# Altium project BEE-1012 PAY-EXP_V110.PrjPcb (part 7 of 7)

## Sheet 21_POWER_PWR_SEN.SchDoc
size 420 x 297 mm; SheetNumber: 34; SheetTotal: 36
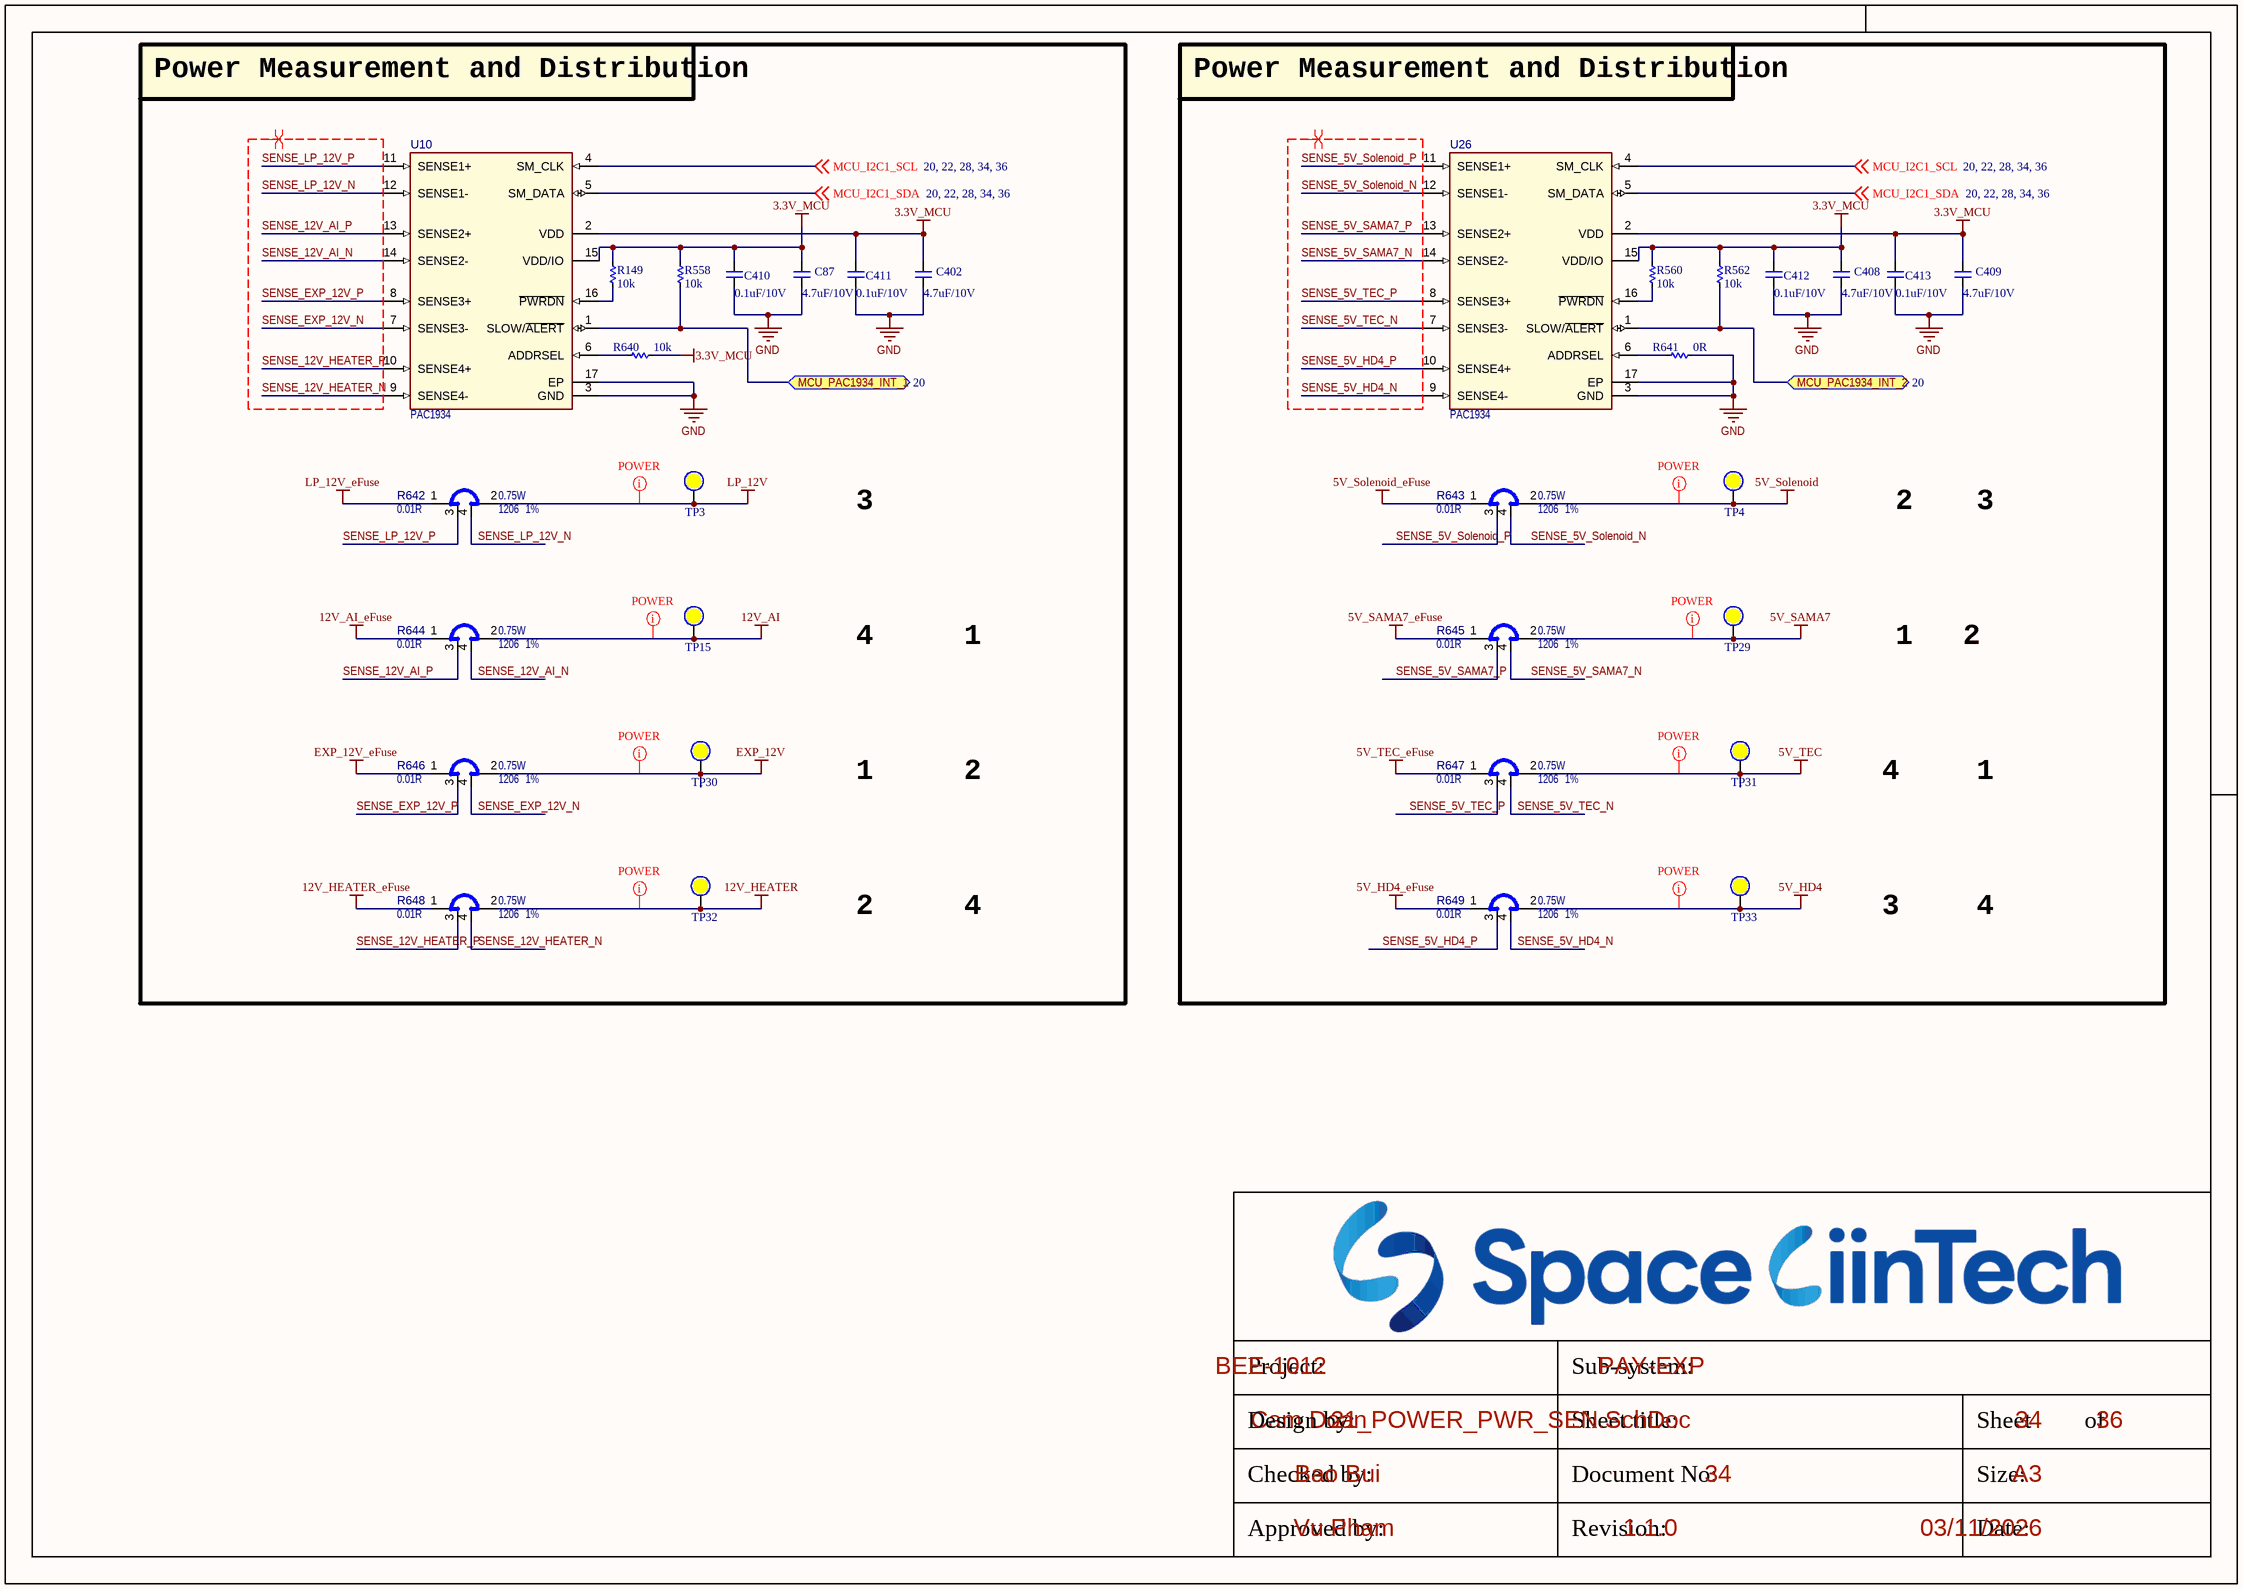
[diagram p35: 21_POWER_PWR_SEN.SchDoc]

### Parts
(Parts that share a designator on the sheet are numbered #1, #2 ... from top to bottom, then left to right.)
C87#2  4.7uF/10V  [CAP_C_1005X60]
C402  4.7uF/10V  [CAP_C_1005X60]
C408  4.7uF/10V  [CAP_C_1005X60]
C409  4.7uF/10V  [CAP_C_1005X60]
C410  0.1uF/10V  [CAP_C_1005X60]
C411  0.1uF/10V  [CAP_C_1005X60]
C412  0.1uF/10V  [CAP_C_1005X60]
C413  0.1uF/10V  [CAP_C_1005X60]
R149#2  10k  [RES_C_1005X40]
R558#1  10k  [RES_C_1005X40]
R560#1  10k  [RES_C_1005X40]
R562#1  10k  [RES_C_1005X40]
R640  10k  [RES_C_1005X40]
R641  0R  [RES_C_1005X40]
R642  value 0.01R  Package: 1206  Tolerance: 1%  Power: 0.75W  [RES_C_1206_SHUNT]  (hidden comment: KRL1632E-M-R010-F-T5)
R643  value 0.01R  Package: 1206  Tolerance: 1%  Power: 0.75W  [RES_C_1206_SHUNT]  (hidden comment: KRL1632E-M-R010-F-T5)
R644  value 0.01R  Package: 1206  Tolerance: 1%  Power: 0.75W  [RES_C_1206_SHUNT]  (hidden comment: KRL1632E-M-R010-F-T5)
R645  value 0.01R  Package: 1206  Tolerance: 1%  Power: 0.75W  [RES_C_1206_SHUNT]  (hidden comment: KRL1632E-M-R010-F-T5)
R646  value 0.01R  Package: 1206  Tolerance: 1%  Power: 0.75W  [RES_C_1206_SHUNT]  (hidden comment: KRL1632E-M-R010-F-T5)
R647  value 0.01R  Package: 1206  Tolerance: 1%  Power: 0.75W  [RES_C_1206_SHUNT]  (hidden comment: KRL1632E-M-R010-F-T5)
R648  value 0.01R  Package: 1206  Tolerance: 1%  Power: 0.75W  [RES_C_1206_SHUNT]  (hidden comment: KRL1632E-M-R010-F-T5)
R649  value 0.01R  Package: 1206  Tolerance: 1%  Power: 0.75W  [RES_C_1206_SHUNT]  (hidden comment: KRL1632E-M-R010-F-T5)
TP3#2  (no value)  [Testpoint_80]  (no BOM)
TP4#2  (no value)  [Testpoint_80]  (no BOM)
TP15  (no value)  [Testpoint_80]  (no BOM)
TP29  (no value)  [Testpoint_80]  (no BOM)
TP30  (no value)  [Testpoint_80]  (no BOM)
TP31  (no value)  [Testpoint_80]  (no BOM)
TP32  (no value)  [Testpoint_80]  (no BOM)
TP33  (no value)  [Testpoint_80]  (no BOM)
U10#2  value PAC1934  [UQFN-16_4X4_EP2.6X2.6]  (hidden comment: PAC1934 UQFN-16)
U26  value PAC1934  [UQFN-16_4X4_EP2.6X2.6]  (hidden comment: PAC1934 UQFN-16)

### Ports
MCU_PAC1934_INT_1 (bidir, see 20), MCU_PAC1934_INT_2 (bidir, see 20)

### Nets
3.3V_MCU: C87#2.1 C402.1 C408.1 C409.1 C410.1 C411.1 C412.1 C413.1 R149#2.1 R558#1.1 R560#1.1 R562#1.1 R640.2 U10#2.2(VDD) U10#2.15(VDD/IO) U26.2(VDD) U26.15(VDD/IO)
5V_HD4: R649.2 TP33.1
5V_HD4_eFuse: R649.1
5V_SAMA7: R645.2 TP29.1
5V_SAMA7_eFuse: R645.1
5V_Solenoid: R643.2 TP4#2.1
5V_Solenoid_eFuse: R643.1
5V_TEC: R647.2 TP31.1
5V_TEC_eFuse: R647.1
12V_AI: R644.2 TP15.1
12V_AI_eFuse: R644.1
12V_HEATER: R648.2 TP32.1
12V_HEATER_eFuse: R648.1
EXP_12V: R646.2 TP30.1
EXP_12V_eFuse: R646.1
GND: C87#2.2 C402.2 C408.2 C409.2 C410.2 C411.2 C412.2 C413.2 R641.2 U10#2.3(GND) U10#2.17(EP) U26.3(GND) U26.17(EP)
LP_12V: R642.2 TP3#2.1
LP_12V_eFuse: R642.1
MCU_I2C1_SCL: U10#2.4(SM_CLK) U26.4(SM_CLK) ; off-sheet MCU_I2C1_SCL
MCU_I2C1_SDA: U10#2.5(SM_DATA) U26.5(SM_DATA) ; off-sheet MCU_I2C1_SDA
SENSE_5V_HD4_N: R649.4 U26.9(SENSE4-)
SENSE_5V_HD4_P: R649.3 U26.10(SENSE4+)
SENSE_5V_SAMA7_N: R645.4 U26.14(SENSE2-)
SENSE_5V_SAMA7_P: R645.3 U26.13(SENSE2+)
SENSE_5V_Solenoid_N: R643.4 U26.12(SENSE1-)
SENSE_5V_Solenoid_P: R643.3 U26.11(SENSE1+)
SENSE_5V_TEC_N: R647.4 U26.7(SENSE3-)
SENSE_5V_TEC_P: R647.3 U26.8(SENSE3+)
SENSE_12V_AI_N: R644.4 U10#2.14(SENSE2-)
SENSE_12V_AI_P: R644.3 U10#2.13(SENSE2+)
SENSE_12V_HEATER_N: R648.4 U10#2.9(SENSE4-)
SENSE_12V_HEATER_P: R648.3 U10#2.10(SENSE4+)
SENSE_EXP_12V_N: R646.4 U10#2.7(SENSE3-)
SENSE_EXP_12V_P: R646.3 U10#2.8(SENSE3+)
SENSE_LP_12V_N: R642.4 U10#2.12(SENSE1-)
SENSE_LP_12V_P: R642.3 U10#2.11(SENSE1+)
NetR149#2_2: R149#2.2 U10#2.16(~{PWRDN})
NetR558#1_2: R558#1.2 U10#2.1(SLOW/~{ALERT}) ; port MCU_PAC1934_INT_1
NetR560#1_2: R560#1.2 U26.16(~{PWRDN})
NetR562#1_2: R562#1.2 U26.1(SLOW/~{ALERT}) ; port MCU_PAC1934_INT_2
NetR640_1: R640.1 U10#2.6(ADDRSEL)
NetR641_1: R641.1 U26.6(ADDRSEL)

### Layout directives
net class POWER: 5V_HD4, 5V_SAMA7, 5V_Solenoid, 5V_TEC, 12V_AI, 12V_HEATER, EXP_12V, LP_12V
differential pair; net class DIFF100; differential pair class DIFF100: SENSE_5V_HD4_N, SENSE_5V_HD4_P, SENSE_5V_SAMA7_N, SENSE_5V_SAMA7_P, SENSE_5V_Solenoid_N, SENSE_5V_Solenoid_P, SENSE_5V_TEC_N, SENSE_5V_TEC_P, SENSE_12V_AI_N, SENSE_12V_AI_P, SENSE_12V_HEATER_N, SENSE_12V_HEATER_P, SENSE_EXP_12V_N, SENSE_EXP_12V_P, SENSE_LP_12V_N, SENSE_LP_12V_P

### Notes on the sheet
- Power Measurement and Distribution
- 3
- 2
- 4
- 1
- Project:
- Sub-system:
- Design by:
- Sheet title:
- Sheet
- of
- Checked by:
- Approved by:
- Revision:
- Document No:
- Size:
- Date:
- A3

### Library data of the parts
C87#2 C402 C408-C413 = _CAP_C_2: CAP
R149#2 R558#1 R560#1 R562#1 R640 R641 = _RES_B_2: RES
R642-R649 = RSMT1316: Shunt; Manufacturer 1: SUSUMU; Description_: RES SHUNT MF 0.01R 1% 0.75W SMD 1206; Dev Tools Status: Design; Temperature Coeffcient: 50ppm/C; Current: 8A; Owner: Ciprian Abramov; Populated: YES; MCHP-ID: RSMT1316; Revision: 1; Symbol: Shunt 4 Pin; Status: MCL Design; ComponentLink1URL: https://chn-vm-apps.microchip.com/mchprepo/parts/Datasheets/n_catalog_partition09_en.pdf; ComponentLink1Description: SVN Datasheet; ComponentLink2URL: C:\ALTIUM_WORK\00001_MCHP-CDB\Datasheets\n_catalog_partition09_en.pdf; ComponentLink2Description: Local Datasheet; ComponentLink3URL: C:\ALTIUM_WORK\00001_MCHP-CDB\Library\LibraryRefs\Shunt 4 Pin.SchLib; ComponentLink3Description: Open Symbol; ComponentLink4URL: C:\ALTIUM_WORK\00001_MCHP-CDB\Library\Footprints\RES_C_1206_SHUNT.PcbLib; ComponentLink4Description: Open Footprint; ComponentLink5Description: Open Footprint 2; ComponentLink6Description: Open Footprint 3; ComponentLink7Description: Open Footprint 4; Operating Temperature: -55C to +155C; Category: Resistor; Type: RES SMD; Composition: MF; Manufacturer Part Number 1: KRL1632E-M-R010-F-T5; Supplier 1: Digi-Key; Supplier Part Number 1: 408-1570-1-ND; Quantity Override: 1
TP3#2 TP4#2 TP15 TP29-TP33 = Test Point: Solder: NF
U10#2 U26 = MIC8883: Manufacturer 1: Microchip Technology; Manufacturer Part Number 1: PAC1934T-I/JQ; Description_: MCHP ANALOG POWER CURRENT SENSE MONITOR PAC1934T-I/JQ UQFN-16; Dev Tools Status: Design; Owner: Ciprian Abramov; Populated: YES; MCHP-ID: MIC8883; Symbol: PAC1934 UQFN-16; Type: Power/Current Sensor; Status: MCL Design; Revision: 1; Category: MCHP-Analog; ComponentLink1Description: SVN Datasheet; ComponentLink2Description: Local Datasheet; ComponentLink3URL: C:\ALTIUM_WORK\00001_MCHP-CDB\Library\LibraryRefs\PAC1934 UQFN-16.SchLib; ComponentLink3Description: Open Symbol; ComponentLink4URL: C:\ALTIUM_WORK\00001_MCHP-CDB\Library\Footprints\UQFN-16_4X4_EP2.6X2.6.PcbLib; ComponentLink4Description: Open Footprint; ComponentLink5Description: Open Footprint 2; ComponentLink6Description: Open Footprint 3; ComponentLink7Description: Open Footprint 4; Supplier 1: Digi-Key; Supplier Part Number 1: PAC1934T-I/JQCT-ND; Quantity Override: 1

## Sheet MOUTING.SchDoc
size 420 x 297 mm; SheetNumber: 35; SheetTotal: 35
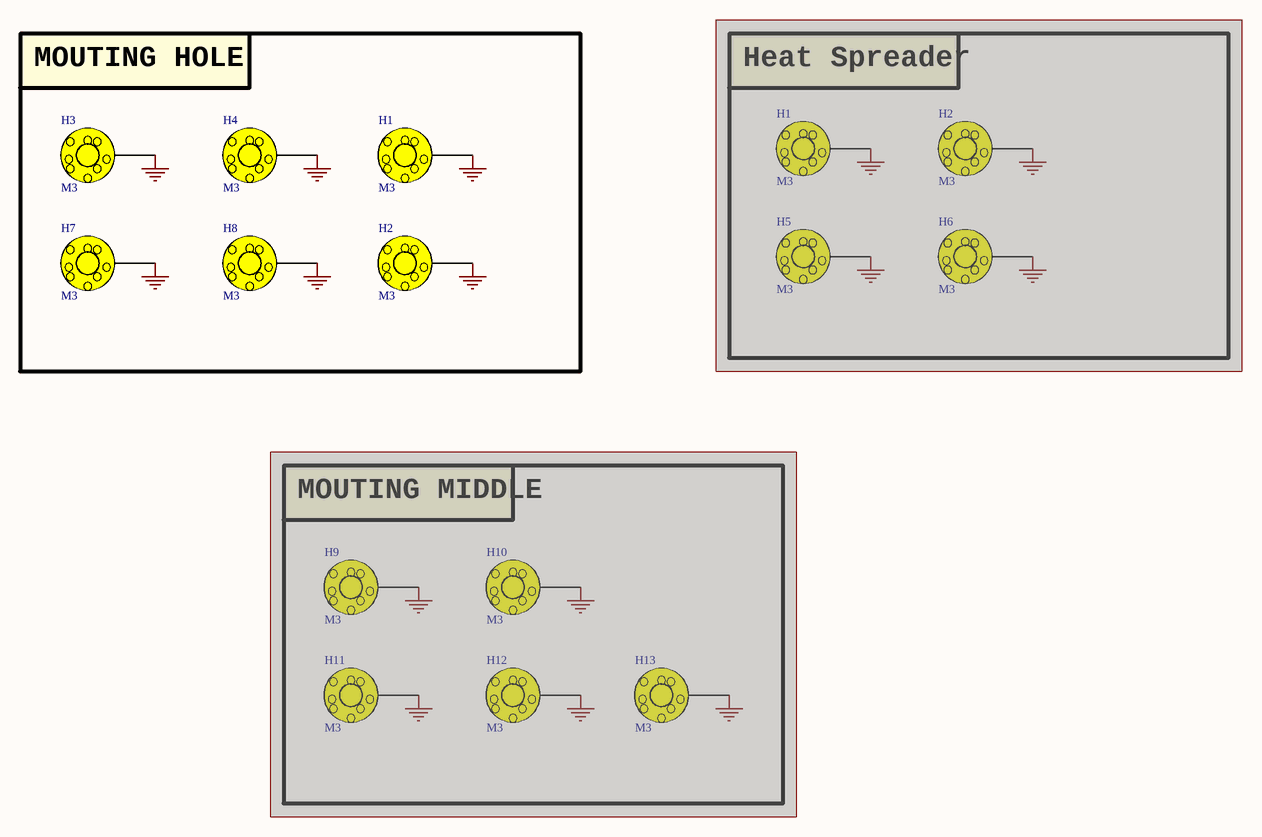
[diagram p36: MOUTING.SchDoc]

### Parts
(Parts that share a designator on the sheet are numbered #1, #2 ... from top to bottom, then left to right.)
H1#1  M3  [HEX-M3_NoVia]  (masked out: inside a compile mask, not in the netlist)
H1#2  M3  [HEX-M3_NoVia]
H2#1  M3  [HEX-M3_NoVia]  (masked out: inside a compile mask, not in the netlist)
H2#2  M3  [HEX-M3_NoVia]
H3  M3  [HEX-M3_NoVia]
H4  M3  [HEX-M3_NoVia]
H5  M3  [HEX-M3_NoVia]  (masked out: inside a compile mask, not in the netlist)
H6  M3  [HEX-M3_NoVia]  (masked out: inside a compile mask, not in the netlist)
H7  M3  [HEX-M3_NoVia]
H8  M3  [HEX-M3_NoVia]
H9  M3  [HEX-M3_NoVia]  (masked out: inside a compile mask, not in the netlist)
H10  M3  [HEX-M3_NoVia]  (masked out: inside a compile mask, not in the netlist)
H11  M3  [HEX-M3_NoVia]  (masked out: inside a compile mask, not in the netlist)
H12  M3  [HEX-M3_NoVia]  (masked out: inside a compile mask, not in the netlist)
H13  M3  [HEX-M3_NoVia]  (masked out: inside a compile mask, not in the netlist)

### Blocks framed on the sheet
MOUTING HOLE: H1#2 H2#2 H3 H4 H7 H8
Heat Spreader: H1#1 H2#1 H5 H6
MOUTING MIDDLE: H9-H13

### Nets
GND: H1#2.1 H2#2.1 H3.1 H4.1 H7.1 H8.1

### Notes on the sheet
- Project:
- Sub-system:
- Design by:
- Sheet title:
- Sheet
- of
- Checked by:
- Approved by:
- Revision:
- Document No:
- Size:
- Date:
- A3

### Library data of the parts
H1#1 H1#2 H2#1 H2#2 H3-H13 = HEX-M3

## Sheet ANA_SWITCH.SchDoc
size 420 x 297 mm; SheetNumber: 36; SheetTotal: 36
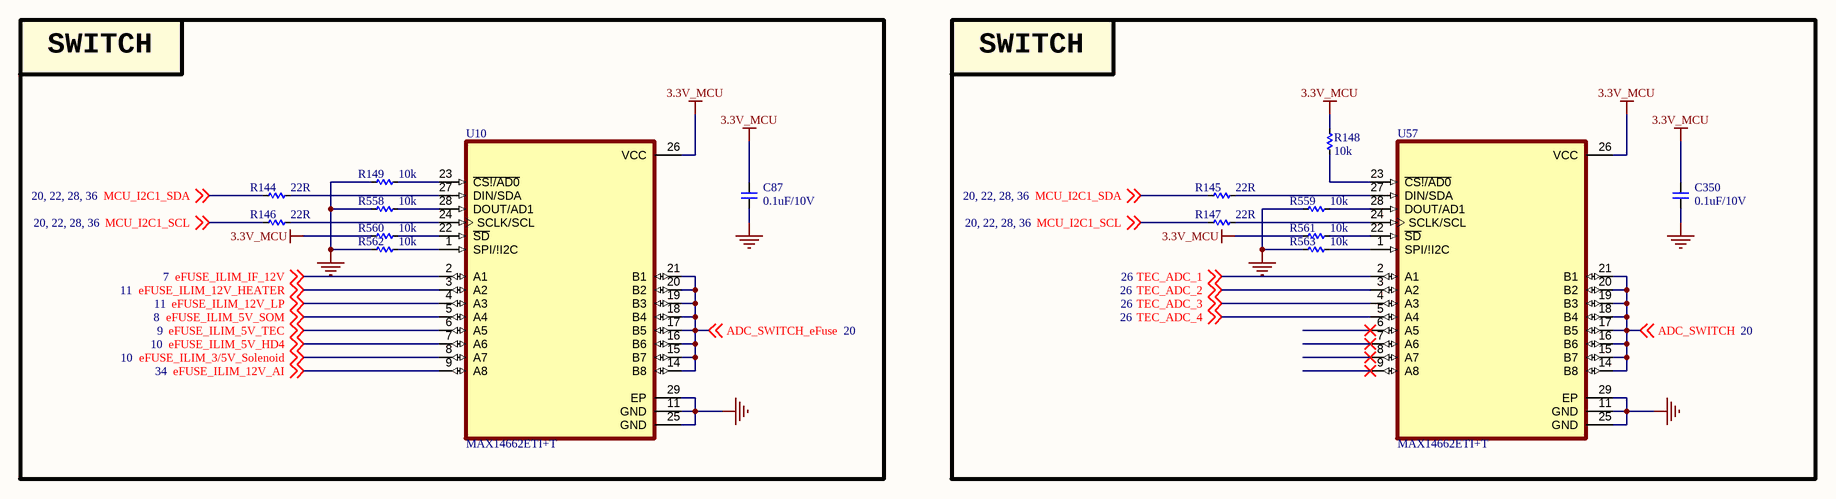
[diagram p37: ANA_SWITCH.SchDoc]

### Parts
(Parts that share a designator on the sheet are numbered #1, #2 ... from top to bottom, then left to right.)
C87#3  0.1uF/10V  [CAP_C_1005X60]
C350  0.1uF/10V  [CAP_C_1005X60]
R144#3  22R  [RES_C_1005X40]
R145#2  22R  [RES_C_1005X40]
R146#3  22R  [RES_C_1005X40]
R147#2  22R  [RES_C_1005X40]
R148#2  10k  [RES_C_1005X40]
R149#3  10k  [RES_C_1005X40]
R558#2  10k  [RES_C_1005X40]
R559  10k  [RES_C_1005X40]
R560#2  10k  [RES_C_1005X40]
R561  10k  [RES_C_1005X40]
R562#2  10k  [RES_C_1005X40]
R563  10k  [RES_C_1005X40]
U10#3  MAX14662ETI+T  [QFN40P400X400X80-29N]
U57  MAX14662ETI+T  [QFN40P400X400X80-29N]

### Blocks framed on the sheet
SWITCH: C87#3 R144#3 R146#3 R149#3 R558#2 R560#2 R562#2 U10#3
SWITCH: C350 R145#2 R147#2 R148#2 R559 R561 R563 U57

### Nets
3.3V_MCU: C87#3.2 C350.2 R148#2.1 R560#2.1 R561.1 U10#3.26(VCC) U57.26(VCC)
GND: C87#3.1 C350.1 R149#3.1 R558#2.1 R559.1 R562#2.1 R563.1 U10#3.11(GND) U10#3.25(GND) U10#3.29(EP) U57.11(GND) U57.25(GND) U57.29(EP)
ADC_SWITCH: U57.14(B8) U57.15(B7) U57.16(B6) U57.17(B5) U57.18(B4) U57.19(B3) U57.20(B2) U57.21(B1) ; off-sheet ADC_SWITCH
ADC_SWITCH_eFuse: U10#3.14(B8) U10#3.15(B7) U10#3.16(B6) U10#3.17(B5) U10#3.18(B4) U10#3.19(B3) U10#3.20(B2) U10#3.21(B1) ; off-sheet ADC_SWITCH_eFuse
eFUSE_ILIM_3/5V_Solenoid: U10#3.8(A7) ; off-sheet eFUSE_ILIM_3/5V_Solenoid
eFUSE_ILIM_5V_HD4: U10#3.7(A6) ; off-sheet eFUSE_ILIM_5V_HD4
eFUSE_ILIM_5V_SOM: U10#3.5(A4) ; off-sheet eFUSE_ILIM_5V_SOM
eFUSE_ILIM_5V_TEC: U10#3.6(A5) ; off-sheet eFUSE_ILIM_5V_TEC
eFUSE_ILIM_12V_AI: U10#3.9(A8) ; off-sheet eFUSE_ILIM_12V_AI
eFUSE_ILIM_12V_HEATER: U10#3.3(A2) ; off-sheet eFUSE_ILIM_12V_HEATER
eFUSE_ILIM_12V_LP: U10#3.4(A3) ; off-sheet eFUSE_ILIM_12V_LP
eFUSE_ILIM_IF_12V: U10#3.2(A1) ; off-sheet eFUSE_ILIM_IF_12V
MCU_I2C1_SCL: R146#3.1 R147#2.1 ; off-sheet MCU_I2C1_SCL
MCU_I2C1_SDA: R144#3.1 R145#2.1 ; off-sheet MCU_I2C1_SDA
TEC_ADC_1: U57.2(A1) ; off-sheet TEC_ADC_1
TEC_ADC_2: U57.3(A2) ; off-sheet TEC_ADC_2
TEC_ADC_3: U57.4(A3) ; off-sheet TEC_ADC_3
TEC_ADC_4: U57.5(A4) ; off-sheet TEC_ADC_4
NetR144#3_2: R144#3.2 U10#3.27(DIN/SDA)
NetR145#2_2: R145#2.2 U57.27(DIN/SDA)
NetR146#3_2: R146#3.2 U10#3.24(SCLK/SCL)
NetR147#2_2: R147#2.2 U57.24(SCLK/SCL)
NetR148#2_2: R148#2.2 U57.23(~{CS!/AD0})
NetR149#3_2: R149#3.2 U10#3.23(~{CS!/AD0})
NetR558#2_2: R558#2.2 U10#3.28(DOUT/AD1)
NetR559_2: R559.2 U57.28(DOUT/AD1)
NetR560#2_2: R560#2.2 U10#3.22(~{SD})
NetR561_2: R561.2 U57.22(~{SD})
NetR562#2_2: R562#2.2 U10#3.1(SPI/!I2C)
NetR563_2: R563.2 U57.1(SPI/!I2C)

Not connected (* = marked no-connect by the designer): U57 6(A5)* 7(A6)* 8(A7)* 9(A8)*

### Notes on the sheet
- Project:
- Sub-system:
- Design by:
- Sheet title:
- Sheet
- of
- Checked by:
- Approved by:
- Revision:
- Document No:
- Size:
- Date:
- A3

### Library data of the parts
C87#3 C350 = _CAP_C_2: CAP
R144#3 R145#2 R146#3 R147#2 R148#2 R149#3 R558#2 R559 R560#2 R561 R562#2 R563 = _RES_B_2: RES
U10#3 U57 = IC_SW_MAX14662ETI+T: 8 Circuit IC Switch 1:1 1Ohm 28-TQFN _4x4_; MF: Maxim Integrated; Package: TQFN-28 Maxim; Value: *; Price: None; MP: MAX14662ETI+T; SnapEDA_Link: https://www.snapeda.com/parts/MAX14662ETI%2BT/Maxim%20Integrated/view-part/546683/?ref=snap; Availability: Unavailable

## Nets that join several sheets
3.3_VBAT: 08_SAMA7G54-MPU (R332.1), 13_MRAM_RTC_WDT (5 pins)
3.3V_MCU: 05_CONNECTOR_OUT (8 pins), 06_POWER_1 (5 pins), 07_CAN (C184.1 C185.1 U41.3), 11_MCU (23 pins), 12_CONSOLE (C141.2 J19.1 R246.2 R247.2), 13_MRAM_RTC_WDT (28 pins), 13_PRAM (12 pins), 14_NTC_TEMPSENSOR (18 pins), 16_TEC (12 pins), 17_FLOW_Sensor (34 pins), 17_I2C_Sensor_OnBoard (13 pins), 18_HD4_PUMP (C117.2 R197.1 R198.1 U17.1), 19_SOLENOID_HB_1 (15 pins), 21_POWER_PWR_SEN (17 pins), ANA_SWITCH (7 pins)
3.3V_SAMA7: 05_CONNECTOR_OUT (R273.1 R274.1 R276.1), 06_POWER_2 (5 pins), 07_CAN (6 pins), 08_SOM_USB_CARD (14 pins), 10_USB (12 pins), 12_CONSOLE (27 pins), 13_MRAM_RTC_WDT (R454.2), 13_PRAM (R580#2.2 R584#2.2)
5V_HD4: 06_POWER_4 (8 pins), 18_HD4_PUMP (10 pins), 21_POWER_PWR_SEN (R649.2 TP33.1)
5V_MCU: 06_POWER_1 (7 pins), 06_POWER_2 (6 pins), 06_POWER_3 (R411.1 R416.1), 06_POWER_4 (R424.1 R432.1), 06_POWER_5 (R128.1 R210.1), 20_AI_Board (R602.1)
5V_PERI: 06_POWER_3 (10 pins), 06_POWER_4 (10 pins)
5V_SAMA7: 05_CONNECTOR_IN (JP19.1), 05_CONNECTOR_OUT (J24.11), 06_POWER_2 (C147.1 DS3.2 VR2.3), 08_SAMA7G54-PMIC (13 pins), 08_SAMA7G54-PIO (R533.1), 21_POWER_PWR_SEN (R645.2 TP29.1)
5V_SAMA7_eFuse: 06_POWER_2 (7 pins), 21_POWER_PWR_SEN (R645.1)
5V_Solenoid: 06_POWER_4 (8 pins), 19_SOLENOID_HB_1 (55 pins), 21_POWER_PWR_SEN (R643.2 TP4#2.1)
5V_TEC: 06_POWER_3 (8 pins), 16_TEC (20 pins), 21_POWER_PWR_SEN (R647.2 TP31.1)
12V_AI: 20_AI_Board (C395.2 C396.2 U73#2.7), 21_POWER_PWR_SEN (R644.2 TP15.1)
12V_AI_eFuse: 20_AI_Board (7 pins), 21_POWER_PWR_SEN (R644.1)
12V_HEATER: 06_POWER_5 (8 pins), 15_HEATER (17 pins), 21_POWER_PWR_SEN (R648.2 TP32.1)
EXP_12V: 06_POWER_1 (C8#2.2 C9.2 U2.7), 06_POWER_3 (C159.2 U35.7), 06_POWER_5 (10 pins), 20_AI_Board (5 pins), 21_POWER_PWR_SEN (R646.2 TP30.1)
EXP_12V_eFuse: 06_POWER_1 (7 pins), 21_POWER_PWR_SEN (R646.1)
GND: 05_CONNECTOR_IN (19 pins), 05_CONNECTOR_OUT (13 pins), 06_POWER_1 (24 pins), 06_POWER_2 (17 pins), 06_POWER_3 (21 pins), 06_POWER_4 (24 pins), 06_POWER_5 (24 pins), 07_CAN (13 pins), 08_SAMA7G54-MPU (115 pins), 08_SAMA7G54-PMIC (29 pins), 08_SAMA7G54-PIO (10 pins), 08_SAMA7G54-DDR3 (84 pins), 08_SOM_USB_CARD (13 pins), 09_eMMC (30 pins), 10_USB (41 pins), 11_MCU (48 pins), 12_CONSOLE (39 pins), 13_MRAM_RTC_WDT (20 pins), 13_PRAM (C387#2.2 U71#2.8 U72#2.8 U73#1.4), 14_NTC_TEMPSENSOR (38 pins), 15_HEATER (21 pins), 16_TEC (54 pins), 17_FLOW_Sensor (30 pins), 17_I2C_Sensor_OnBoard (10 pins), 18_HD4_PUMP (14 pins), 18_HD4_PUMP_2 (9 pins), 19_SOLENOID_HB_1 (45 pins), 19_SOLENOID_OF (10 pins), 20_AI_Board (25 pins), 21_POWER_PWR_SEN (13 pins), MOUTING (6 pins), ANA_SWITCH (13 pins)
IF_12V: 05_CONNECTOR_IN (J1.1 J1.2 J1.3 TP3#1.1), 06_POWER_1 (5 pins)
LP_12V: 05_CONNECTOR_OUT (J21.1 J22.1 J23.1), 06_POWER_5 (8 pins), 18_HD4_PUMP_2 (5 pins), 21_POWER_PWR_SEN (R642.2 TP3#2.1)
VDD_3V3: 05_CONNECTOR_IN (9 pins), 05_CONNECTOR_OUT (R352.1 R359.1), 08_SAMA7G54-MPU (7 pins), 08_SAMA7G54-PMIC (18 pins), 08_SAMA7G54-PIO (6 pins), 08_SOM_USB_CARD (C191.2 JP7.2 R455.2 U42.8), 09_eMMC (38 pins)
VDD_3V3_MPU: 08_SAMA7G54-MPU (36 pins), 08_SAMA7G54-PMIC (5 pins)
VDDCORE: 08_SAMA7G54-MPU (30 pins), 08_SAMA7G54-PMIC (R344.2 TP8.1)
VDDCPU: 08_SAMA7G54-MPU (11 pins), 08_SAMA7G54-PMIC (R349.2 TP10.1)
VDDIODDR: 08_SAMA7G54-PMIC (R354.2 TP16.1), 08_SAMA7G54-DDR3 (73 pins)
ADC_SWITCH: 11_MCU (R79.1), ANA_SWITCH (8 pins)
ADC_TEMP1: 11_MCU (R143.2), 14_NTC_TEMPSENSOR (C98.2 R174.2)
ADC_TEMP2: 11_MCU (R150.2), 14_NTC_TEMPSENSOR (C94.2 R168.2)
ADC_TEMP3: 11_MCU (R108.2), 14_NTC_TEMPSENSOR (C106.2 R180.2)
ADC_TEMP4: 11_MCU (R75.1), 14_NTC_TEMPSENSOR (C110.2 R186.2)
ADC_TEMP5: 11_MCU (R89.2), 14_NTC_TEMPSENSOR (C101.2 R175.2)
ADC_TEMP6: 11_MCU (R84.2), 14_NTC_TEMPSENSOR (C95.2 R169.2)
ADC_TEMP7: 11_MCU (R278.2), 14_NTC_TEMPSENSOR (C107.2 R181.2)
ADC_TEMP8: 11_MCU (R106.2), 14_NTC_TEMPSENSOR (C113.2 R187.2)
CAN_H: 07_CAN (5 pins), 20_AI_Board (J20.5)
CAN_L: 07_CAN (5 pins), 20_AI_Board (J20.4)
CANRX1: 07_CAN (U41.4), 11_MCU (R82.2)
CANTX1: 07_CAN (U41.1), 11_MCU (R87.2)
CPU_IR_LED_PWM: 08_SAMA7G54-PIO (R653.1), 18_HD4_PUMP_2 (R655.2 R656.1)
CPU_MCU_SPI_CS: 08_SAMA7G54-PIO (R309.1), 11_MCU (R286.2)
CPU_WD_nRESET: 08_SAMA7G54-MPU (R505.1 U29.J7), 08_SAMA7G54-PMIC (R340.1 U51.2), 08_SAMA7G54-PIO (C300.2 R535.1)
eFUSE_ILIM_3/5V_Solenoid: 06_POWER_4 (R439.2 U38.9), ANA_SWITCH (U10#3.8)
eFUSE_ILIM_5V_HD4: 06_POWER_4 (R431.2 U37.9), ANA_SWITCH (U10#3.7)
eFUSE_ILIM_5V_SOM: 06_POWER_2 (R255.2 U24.9), ANA_SWITCH (U10#3.5)
eFUSE_ILIM_5V_TEC: 06_POWER_3 (R423.2 U36.9), ANA_SWITCH (U10#3.6)
eFUSE_ILIM_12V_AI: 20_AI_Board (R612.2 U48.9), ANA_SWITCH (U10#3.9)
eFUSE_ILIM_12V_HEATER: 06_POWER_5 (R341.2 U44.9), ANA_SWITCH (U10#3.3)
eFUSE_ILIM_12V_LP: 06_POWER_5 (R209.2 U43.9), ANA_SWITCH (U10#3.4)
eFUSE_ILIM_IF_12V: 06_POWER_1 (R6#2.2 U1#2.9), ANA_SWITCH (U10#3.2)
HEATER_PWM_1: 11_MCU (R52.2), 15_HEATER (R152.1)
HEATER_PWM_2: 11_MCU (R11.2), 15_HEATER (R159.1)
HEATER_PWM_3: 11_MCU (R13.2), 15_HEATER (R164.1)
HEATER_PWM_4: 11_MCU (R50.2), 15_HEATER (R166.1)
HEATER_PWM_5: 11_MCU (R74.2), 15_HEATER (R153.1)
HEATER_PWM_6: 11_MCU (R101.2), 15_HEATER (R160.1)
HEATER_PWM_7: 11_MCU (R70.2), 15_HEATER (R154.1)
HEATER_PWM_8: 11_MCU (R71.2), 15_HEATER (R158.1)
IF_MCU_SHUTDOWN: 05_CONNECTOR_IN (J1.7), 11_MCU (R312.1)
IF_USB_N: 05_CONNECTOR_IN (J2.8 R625.1), 12_CONSOLE (U32.30)
IF_USB_P: 05_CONNECTOR_IN (J2.7 R626.1), 12_CONSOLE (U32.31)
LASER_ADC_1: 05_CONNECTOR_OUT (J23.10), 11_MCU (R73.1)
LASER_ADC_2: 05_CONNECTOR_OUT (J23.11), 11_MCU (R77.1)
LASER_DAC_LATCH: 05_CONNECTOR_OUT (J23.7 R292.2), 11_MCU (R91.2)
LASER_SPI_nCS1: 05_CONNECTOR_OUT (J23.6 R291.2), 11_MCU (R59.2)
LASER_SW_EXT_CS: 05_CONNECTOR_OUT (J23.9 R294.2), 11_MCU (R37.2)
LASER_SW_INT_CS: 05_CONNECTOR_OUT (J23.8 R293.2), 11_MCU (R72.2)
LPM: 08_SAMA7G54-MPU (U29.R10), 08_SAMA7G54-PMIC (Q27.1 R331.1)
LSM6DSOX_INT: 11_MCU (R99.2), 17_I2C_Sensor_OnBoard (R296.2 U49.4)
MCP16502_HPM: 08_SAMA7G54-PMIC (R333.1), 08_SAMA7G54-PIO (R386.1 R533.2 R536.1)
MCU_CONSOLE_RX: 11_MCU (R49.1), 12_CONSOLE (R247.1 R283.2)
MCU_CONSOLE_TX: 11_MCU (R51.1), 12_CONSOLE (R246.1 R279.2)
MCU_FRAM_nCS: 11_MCU (R41.2), 13_MRAM_RTC_WDT (R450.1 U56.1)
MCU_HD4_I2C2_SCL: 11_MCU (R55.1), 18_HD4_PUMP (R22.1 R197.2)
MCU_HD4_I2C2_SDA: 11_MCU (R53.1), 18_HD4_PUMP (R40.1 R198.2)
MCU_HD4_I2C_EN: 11_MCU (R93.2), 18_HD4_PUMP (R203.1 U17.5)
MCU_I2C0_SCL: 11_MCU (R20.2), 17_FLOW_Sensor (7 pins)
MCU_I2C0_SDA: 11_MCU (R17.2), 17_FLOW_Sensor (7 pins)
MCU_I2C1_SCL: 11_MCU (R86.1), 13_MRAM_RTC_WDT (R399.1 U31.4), 17_I2C_Sensor_OnBoard (R503.1 R628.1), 21_POWER_PWR_SEN (U10#2.4 U26.4), ANA_SWITCH (R146#3.1 R147#2.1)
MCU_I2C1_SDA: 11_MCU (R81.1), 13_MRAM_RTC_WDT (R400.1 U31.5), 17_I2C_Sensor_OnBoard (R502.2 R629.1), 21_POWER_PWR_SEN (U10#2.5 U26.5), ANA_SWITCH (R144#3.1 R145#2.1)
MCU_LASER_QSPI_MISO: 05_CONNECTOR_OUT (J23.4), 11_MCU (R524.2)
MCU_LASER_QSPI_MOSI: 05_CONNECTOR_OUT (J23.3), 11_MCU (R458.2)
MCU_LASER_QSPI_SCK: 05_CONNECTOR_OUT (J23.5), 11_MCU (R632.2)
MCU_MRAM_QSPI_CLK: 11_MCU (R34.2 R632.1), 13_MRAM_RTC_WDT (R635.1)
MCU_MRAM_QSPI_IO0: 11_MCU (R32.2 R458.1), 13_MRAM_RTC_WDT (R636.1)
MCU_MRAM_QSPI_IO1: 11_MCU (R30.2 R524.1), 13_MRAM_RTC_WDT (R623.2)
MCU_PRAM_SPI1_nCS: 11_MCU (R105.2), 13_MRAM_RTC_WDT (R530.1 U71#1.2), 13_PRAM (R583#2.1 U71#2.2)
MCU_PRAM_SW_SEL: 11_MCU (R457.2), 13_MRAM_RTC_WDT (R526.1 U71#1.1)
MCU_RAM_QSPI_nCS: 11_MCU (R28.2), 13_MRAM_RTC_WDT (R396.1 U30.1)
MCU_RTC_CLKOUT: 11_MCU (R68.2), 13_MRAM_RTC_WDT (R397.1 U31.3)
MCU_RTC_INT: 11_MCU (R69.2), 13_MRAM_RTC_WDT (R398.1 U31.7)
MCU_SENSOR1_nIRQ: 11_MCU (R126.1), 17_FLOW_Sensor (J13.1)
MCU_SENSOR2_nIRQ: 11_MCU (R127.1), 17_FLOW_Sensor (J14.1)
MCU_SENSOR3_nIRQ: 11_MCU (R57.2), 17_FLOW_Sensor (J27.1)
MCU_SENSOR4_nIRQ: 11_MCU (R277.2), 17_FLOW_Sensor (J28.1)
MCU_SOM_GPIO_A: 08_SAMA7G54-PIO (R392.1), 11_MCU (R25.1)
MCU_SOM_GPIO_B: 08_SAMA7G54-PIO (R388.1), 11_MCU (R27.1)
MCU_SPI0_CMD_SOLE_A: 11_MCU (R622.2), 19_SOLENOID_HB_1 (R476.1)
MCU_SPI0_CMD_SOLE_B: 11_MCU (R620.1), 19_SOLENOID_HB_1 (R498.1)
MCU_SPI0_CMD_SOLE_C: 11_MCU (R617.1), 19_SOLENOID_HB_1 (R572.1)
MCU_SPI0_CMD_SOLE_D: 11_MCU (R616.1), 19_SOLENOID_HB_1 (R477.1)
MCU_SPI0_CMD_SOLE_E: 11_MCU (R615.2), 19_SOLENOID_HB_1 (R500.1)
MCU_SPI0_MISO: 05_CONNECTOR_OUT (R557.1), 11_MCU (R42.1 R141.2)
MCU_SPI0_MOSI: 05_CONNECTOR_OUT (R555.1), 11_MCU (R43.1)
MCU_SPI0_nCS_SOLE_A: 11_MCU (R621.1), 19_SOLENOID_HB_1 (R369.1)
MCU_SPI0_nCS_SOLE_B: 11_MCU (R619.1), 19_SOLENOID_HB_1 (R488.1)
MCU_SPI0_nCS_SOLE_C: 11_MCU (R613.1), 19_SOLENOID_HB_1 (R568.1)
MCU_SPI0_nCS_SOLE_D: 11_MCU (R618.1), 19_SOLENOID_HB_1 (R372.1)
MCU_SPI0_nCS_SOLE_E: 11_MCU (R614.2), 19_SOLENOID_HB_1 (R493.1)
MCU_SPI0_SCK: 05_CONNECTOR_OUT (R314.1), 11_MCU (R45.1)
MCU_SPI1_MISO: 08_SAMA7G54-PIO (R456.1), 11_MCU (R103.2 R285.2), 13_MRAM_RTC_WDT (U71#1.14), 13_PRAM (U71#2.14)
MCU_SPI1_MOSI: 08_SAMA7G54-PIO (R395.1), 11_MCU (R104.2), 13_MRAM_RTC_WDT (U71#1.11), 13_PRAM (U71#2.11)
MCU_SPI1_SCK: 08_SAMA7G54-PIO (R308.1), 11_MCU (R102.2), 13_MRAM_RTC_WDT (U71#1.5), 13_PRAM (U71#2.5)
MCU_UART0_RX_SOM_TX: 08_SAMA7G54-PIO (R528.1), 11_MCU (R24.2)
MCU_UART0_TX_SOM_RX: 08_SAMA7G54-PIO (R529.1), 11_MCU (R26.2)
MCU_USART_RXD2: 11_MCU (R131.1), 13_MRAM_RTC_WDT (U56.2), 16_TEC (U6.18 U7.18 U8.18 U9.18), 19_SOLENOID_HB_1 (10 pins)
MCU_USART_SCK2: 11_MCU (R39.1), 13_MRAM_RTC_WDT (U56.6), 16_TEC (U6.16 U7.16 U8.16 U9.16), 19_SOLENOID_HB_1 (5 pins)
MCU_USART_TXD2: 11_MCU (R133.1), 13_MRAM_RTC_WDT (U56.5), 16_TEC (U6.17 U7.17 U8.17 U9.17), 19_SOLENOID_HB_1 (5 pins)
MCU_WD_DONE: 11_MCU (R65.1), 13_MRAM_RTC_WDT (U34.4)
MCU_WD_nRESET: 11_MCU (R303.2), 13_MRAM_RTC_WDT (R408.1)
MCU_WD_WAKE: 11_MCU (R67.1), 13_MRAM_RTC_WDT (U34.5)
MIPI_CK_N: 05_CONNECTOR_OUT (R575.1), 08_SAMA7G54-MPU (U29.N20)
MIPI_CK_P: 05_CONNECTOR_OUT (R576.1), 08_SAMA7G54-MPU (U29.N21)
MIPI_D0_N: 05_CONNECTOR_OUT (R391.1), 08_SAMA7G54-MPU (U29.R18)
MIPI_D0_P: 05_CONNECTOR_OUT (R486.1), 08_SAMA7G54-MPU (U29.P18)
MIPI_D1_N: 05_CONNECTOR_OUT (R516.1), 08_SAMA7G54-MPU (U29.R20)
MIPI_D1_P: 05_CONNECTOR_OUT (R574.1), 08_SAMA7G54-MPU (U29.R21)
NetC355_1: 08_SAMA7G54-MPU (C355.1 JP15.1), 08_SAMA7G54-PMIC (U51.24), 11_MCU (R107.2)
NetQ27_3: 08_SAMA7G54-MPU (Y2.1), 08_SAMA7G54-PMIC (Q27.3 R350.2)
NetR337_2: 08_SAMA7G54-PMIC (R337.2 U52.1), 08_SAMA7G54-PIO (R588#1.1)
NetR342_1: 08_SAMA7G54-PMIC (R342.1 U51.1), 08_SAMA7G54-PIO (U29.D19)
NetR558#1_2: 11_MCU (R631.2), 21_POWER_PWR_SEN (R558#1.2 U10#2.1)
NetR562#1_2: 11_MCU (R650.2), 21_POWER_PWR_SEN (R562#1.2 U26.1)
OBC_CAN_H: 05_CONNECTOR_IN (J1.9), 07_CAN (R440.1)
OBC_CAN_L: 05_CONNECTOR_IN (J1.8), 07_CAN (R444.1)
PHOTO_ADC_CONV: 05_CONNECTOR_OUT (J21.8 R271.2), 11_MCU (R36.2)
PHOTO_ADC_CS: 05_CONNECTOR_OUT (J21.7 R270.2), 11_MCU (R12.1)
PHOTO_ADC_EOC: 05_CONNECTOR_OUT (J21.9 R272.2), 11_MCU (R151.2)
PHOTO_SPI0_nCS2: 05_CONNECTOR_OUT (J21.6 R269.2), 11_MCU (R31.1)
POW_ONOFF_AI: 11_MCU (R624.2), 20_AI_Board (R602.2 R610.1 U48.1)
POW_ONOFF_BUCK_PERI: 06_POWER_3 (R411.2 R414.1 U35.5), 11_MCU (R282.1)
POW_ONOFF_HD4: 06_POWER_4 (R424.2 R429.1 U37.1), 11_MCU (R18.1)
POW_ONOFF_HEATER: 06_POWER_5 (R210.2 R223.1 U44.1), 11_MCU (R280.2)
POW_ONOFF_LP: 06_POWER_5 (R128.2 R139.1 U43.1), 11_MCU (R23.1)
POW_ONOFF_Solenoid: 06_POWER_4 (R432.2 R437.1 U38.1), 11_MCU (R16.1)
POW_ONOFF_SOM: 06_POWER_2 (R248.2 R252.1 U24.1), 11_MCU (R21.1)
POW_ONOFF_TEC: 06_POWER_3 (R416.2 R421.1 U36.1), 11_MCU (R19.1)
RS422_DE: 05_CONNECTOR_IN (R305.2 U54.3), 08_SAMA7G54-PIO (R600.1)
RS422_~{RE}: 05_CONNECTOR_IN (R304.2 U54.2), 08_SAMA7G54-PIO (R531.1)
SAM7_FLEX1_I2C_SCL: 08_SAMA7G54-PMIC (R329.2 U51.6 U52.4), 08_SAMA7G54-PIO (R515.1)
SAM7_FLEX1_I2C_SDA: 08_SAMA7G54-PMIC (R330.2 U51.5 U52.5), 08_SAMA7G54-PIO (R514.1)
SD2_CLK: 08_SAMA7G54-PIO (R485.1), 08_SOM_USB_CARD (J17.P5 R231.1 U21.3)
SD2_CMD: 08_SAMA7G54-PIO (R459.1), 08_SOM_USB_CARD (J17.P3 R232.1 U22.6)
SD2_DATA0: 08_SAMA7G54-PIO (R487.1), 08_SOM_USB_CARD (J17.P7 R227.1 U21.6)
SD2_DATA1: 08_SAMA7G54-PIO (R510.1), 08_SOM_USB_CARD (J17.P8 R228.1 U21.1)
SD2_DATA2: 08_SAMA7G54-PIO (R511.1), 08_SOM_USB_CARD (J17.P1 R229.1 U22.3)
SD2_DATA3: 08_SAMA7G54-PIO (R512.1), 08_SOM_USB_CARD (J17.P2 R230.1 U22.4)
SD2_nCD: 08_SAMA7G54-PIO (R513.1), 08_SOM_USB_CARD (J17.P9 R226.1)
SENSOR1_EN: 11_MCU (R76.2), 17_FLOW_Sensor (R213.1 U18.5)
SENSOR2_EN: 11_MCU (R78.2), 17_FLOW_Sensor (R217.1 U19.5)
SENSOR3_EN: 11_MCU (R54.2), 17_FLOW_Sensor (R462.1 U45.5)
SENSOR4_EN: 11_MCU (R56.2), 17_FLOW_Sensor (R465.1 U46.5)
SENSOR5_EN: 11_MCU (R80.2), 17_FLOW_Sensor (R225.1 U20.5)
SHDN: 08_SAMA7G54-MPU (U29.R9), 08_SAMA7G54-PMIC (R335.1)
SOLENOID_CTR_1: 11_MCU (R44.2), 19_SOLENOID_OF (R466.2)
SOLENOID_CTR_2: 11_MCU (R46.2), 19_SOLENOID_OF (R467.2)
SOLENOID_CTR_3: 11_MCU (R47.2), 19_SOLENOID_OF (R468.2)
SOLENOID_CTR_4: 11_MCU (R48.2), 19_SOLENOID_OF (R469.2)
SOM_AI_RX: 08_SAMA7G54-PIO (R598.1), 20_AI_Board (R565.1)
SOM_AI_TX: 08_SAMA7G54-PIO (R597.1), 20_AI_Board (R566.1)
SOM_CAM_I2C_SCL: 05_CONNECTOR_OUT (R352.2 R577.1), 08_SAMA7G54-PIO (R520.1)
SOM_CAM_I2C_SDA: 05_CONNECTOR_OUT (R359.2 R627.1), 08_SAMA7G54-PIO (R522.1)
SOM_CANRX0: 07_CAN (U39.4), 08_SAMA7G54-PIO (R519.1)
SOM_CANRX1: 07_CAN (U40.4), 08_SAMA7G54-PIO (R523.1)
SOM_CANTX0: 07_CAN (U39.1), 08_SAMA7G54-PIO (R517.1)
SOM_CANTX1: 07_CAN (U40.1), 08_SAMA7G54-PIO (R521.1)
SOM_CONSOLE_RX: 08_SAMA7G54-PIO (R527.1), 12_CONSOLE (R245.1 R268.2 R316.2)
SOM_CONSOLE_TX: 08_SAMA7G54-PIO (R525.1), 12_CONSOLE (R244.1 R267.2 R295.2)
SOM_EMMC_nRST: 08_SAMA7G54-PIO (R360.1), 09_eMMC (R243.1 U23.M5)
SOM_EXT_LASER_ADC: 05_CONNECTOR_OUT (J22.11), 08_SAMA7G54-PIO (R275.1)
SOM_EXT_LASER_ADC_nCS: 05_CONNECTOR_OUT (J22.6 R273.2), 08_SAMA7G54-PIO (R370.1)
SOM_EXT_LASER_ADC_nCS1: 05_CONNECTOR_OUT (J22.9 R276.2), 08_SAMA7G54-PIO (R583#1.1)
SOM_EXT_LASER_LATCH: 05_CONNECTOR_OUT (J22.7 R274.2), 08_SAMA7G54-PIO (R387.1)
SOM_EXT_LASER_SPI_MISO: 05_CONNECTOR_OUT (R556.1), 08_SAMA7G54-PIO (R364.1)
SOM_EXT_LASER_SPI_MOSI: 05_CONNECTOR_OUT (R554.1), 08_SAMA7G54-PIO (R362.1)
SOM_EXT_LASER_SPI_SCK: 05_CONNECTOR_OUT (R630.1), 08_SAMA7G54-PIO (R367.1)
SOM_MRAM_QSPI_CLK: 08_SAMA7G54-PIO (R385.1), 08_SOM_USB_CARD (U42.6)
SOM_MRAM_QSPI_IO0: 08_SAMA7G54-PIO (R383.1), 08_SOM_USB_CARD (U42.5)
SOM_MRAM_QSPI_IO1: 08_SAMA7G54-PIO (R382.1), 08_SOM_USB_CARD (U42.2)
SOM_MRAM_QSPI_IO2: 08_SAMA7G54-PIO (R380.1), 08_SOM_USB_CARD (U42.3)
SOM_MRAM_QSPI_IO3: 08_SAMA7G54-PIO (R378.1), 08_SOM_USB_CARD (U42.7)
SOM_OBC_I2C9_SCL: 05_CONNECTOR_IN (J2.6 R60.2), 08_SAMA7G54-PIO (R595.1)
SOM_OBC_I2C9_SDA: 05_CONNECTOR_IN (J2.5 R38.2), 08_SAMA7G54-PIO (R594.1)
SOM_PRAM_nCS: 08_SAMA7G54-PIO (R582#1.1), 13_MRAM_RTC_WDT (R454.1 U71#1.3), 13_PRAM (R580#2.1 U71#2.3)
SOM_PRAM_SPI_MISO: 08_SAMA7G54-PIO (R580#1.1), 13_MRAM_RTC_WDT (U71#1.13), 13_PRAM (U71#2.13)
SOM_PRAM_SPI_MOSI: 08_SAMA7G54-PIO (R579#1.1), 13_MRAM_RTC_WDT (U71#1.10), 13_PRAM (U71#2.10)
SOM_PRAM_SPI_SCK: 08_SAMA7G54-PIO (R581#1.1), 13_MRAM_RTC_WDT (U71#1.6), 13_PRAM (U71#2.6)
SOM_RAM_QSPI_nCS: 08_SAMA7G54-PIO (R384.1), 08_SOM_USB_CARD (R351.2)
SOM_RS422_RX: 05_CONNECTOR_IN (R14.2), 08_SAMA7G54-PIO (R601.1)
SOM_RS422_TX: 05_CONNECTOR_IN (R15.2), 08_SAMA7G54-PIO (R599.1)
SOM_SDMMC0_CD_PA14: 08_SAMA7G54-PIO (R509.1), 09_eMMC (R201.1)
SOM_SDMMC0_OUT_CK: 08_SAMA7G54-PIO (R355.1), 09_eMMC (R242.1 U23.P6)
SOM_SDMMC0_OUT_CMD: 08_SAMA7G54-PIO (R357.1), 09_eMMC (R241.1 U23.P5)
SOM_SDMMC0_OUT_D0: 08_SAMA7G54-PIO (R363.1), 09_eMMC (R240.1 U23.K2)
SOM_SDMMC0_OUT_D1: 08_SAMA7G54-PIO (R365.1), 09_eMMC (R239.1 U23.N2)
SOM_SDMMC0_OUT_D2: 08_SAMA7G54-PIO (R368.1), 09_eMMC (R238.1 U23.K3)
SOM_SDMMC0_OUT_D3: 08_SAMA7G54-PIO (R371.1), 09_eMMC (R237.1 U23.N3)
SOM_SDMMC0_OUT_D4: 08_SAMA7G54-PIO (R373.1), 09_eMMC (R236.1 U23.N8)
SOM_SDMMC0_OUT_D5: 08_SAMA7G54-PIO (R375.1), 09_eMMC (R235.1 U23.K8)
SOM_SDMMC0_OUT_D6: 08_SAMA7G54-PIO (R377.1), 09_eMMC (R234.1 U23.N9)
SOM_SDMMC0_OUT_D7: 08_SAMA7G54-PIO (R379.1), 09_eMMC (R233.1 U23.K9)
SOM_SDMMC0_OUT_DS: 08_SAMA7G54-PIO (R381.1), 09_eMMC (U23.K5)
SOM_USB_LED_1: 08_SAMA7G54-PIO (R532.1), 10_USB (R113.1)
SOM_USB_LED_2: 08_SAMA7G54-PIO (R578#1.1), 10_USB (R118.1)
SOM_USER_BUTTON_PA12: 08_SAMA7G54-MPU (R507.1), 08_SAMA7G54-PIO (R508.1)
TEC_ADC_1: 16_TEC (U6.20), ANA_SWITCH (U57.2)
TEC_ADC_2: 16_TEC (U8.20), ANA_SWITCH (U57.3)
TEC_ADC_3: 16_TEC (U7.20), ANA_SWITCH (U57.4)
TEC_ADC_4: 16_TEC (U9.20), ANA_SWITCH (U57.5)
TEC_nCS_1: 11_MCU (R95.2), 16_TEC (R124.2 U6.15)
TEC_nCS_2: 11_MCU (R98.2), 16_TEC (R134.2 U8.15)
TEC_nCS_3: 11_MCU (R100.2), 16_TEC (R125.2 U7.15)
TEC_nCS_4: 11_MCU (R29.1), 16_TEC (R135.2 U9.15)
TEC_SWEN_1: 11_MCU (R58.2), 16_TEC (R130.1 U6.13)
TEC_SWEN_2: 11_MCU (R33.1), 16_TEC (R140.1 U8.13)
TEC_SWEN_3: 11_MCU (R64.2), 16_TEC (R132.1 U7.13)
TEC_SWEN_4: 11_MCU (R66.2), 16_TEC (R142.1 U9.13)
TEMP _SENSOR: 11_MCU (R281.1), 14_NTC_TEMPSENSOR (U15.2)
USB_1_PWR_EN: 08_SAMA7G54-PIO (R356.1), 10_USB (R123.1 U5.1)
USB_1_PWR_nFAIL: 08_SAMA7G54-PIO (R358.1), 10_USB (U5.2)
USB_2_PWR_EN: 08_SAMA7G54-PIO (R390.1), 10_USB (R122.1 U5.4)
USB_2_PWR_nFAIL: 08_SAMA7G54-PIO (R361.1), 10_USB (U5.3)
USBA_N: 08_SAMA7G54-MPU (U29.B3), 12_CONSOLE (U32.3)
USBA_P: 08_SAMA7G54-MPU (U29.A3), 12_CONSOLE (U32.4)
USBB_N: 08_SAMA7G54-MPU (U29.B4), 20_AI_Board (J20.7)
USBB_P: 08_SAMA7G54-MPU (U29.A4), 20_AI_Board (J20.8)
USBC_N: 08_SAMA7G54-MPU (U29.B6), 10_USB (U4.30)
USBC_P: 08_SAMA7G54-MPU (U29.A6), 10_USB (U4.31)
WKUP: 08_SAMA7G54-MPU (U29.AA15), 08_SAMA7G54-PMIC (R339.1 U51.7)